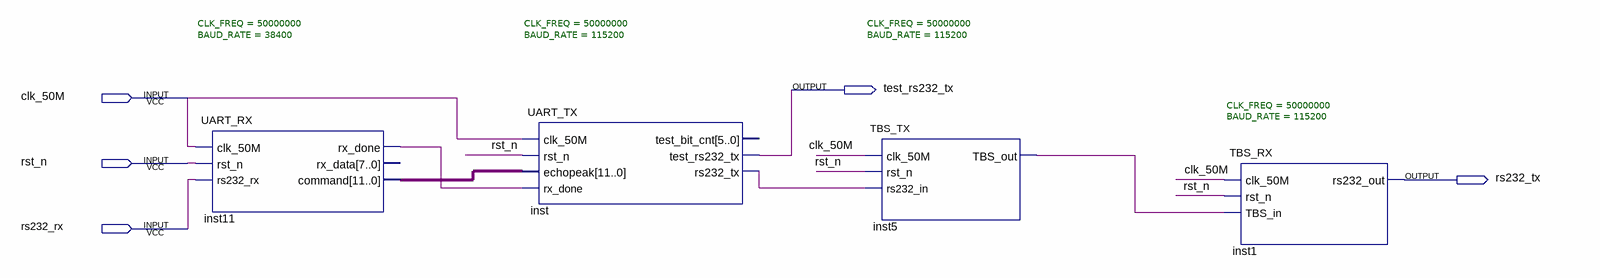
[diagram p0: schematic sheet]
// Quartus schematic TBS.bdf as structural Verilog: 4 symbols, 5 pins
module TBS (
  input  clk_50M,
  input  rst_n,
  input  rs232_rx,
  output test_rs232_tx,
  output rs232_tx
);

  wire inst5_tbs_out, inst11_rx_done, inst_rs232_tx;
  wire [11:0] inst11_command;

  UART_RX #(.CLK_FREQ(50000000), .BAUD_RATE(38400)) inst11 (
    .clk_50M(clk_50M), .rst_n(rst_n), .rs232_rx(rs232_rx), .rx_done(inst11_rx_done), .command(inst11_command));  // open: rx_data
  UART_TX #(.CLK_FREQ(50000000), .BAUD_RATE(115200)) inst (
    .clk_50M(clk_50M), .rst_n(rst_n), .echopeak(inst11_command), .rx_done(inst11_rx_done),
    .test_rs232_tx(test_rs232_tx), .rs232_tx(inst_rs232_tx));  // open: test_bit_cnt
  TBS_TX #(.CLK_FREQ(50000000), .BAUD_RATE(115200)) inst5 (
    .clk_50M(clk_50M), .rst_n(rst_n), .rs232_in(inst_rs232_tx), .TBS_out(inst5_tbs_out));
  TBS_RX #(.CLK_FREQ(50000000), .BAUD_RATE(115200)) inst1 (
    .clk_50M(clk_50M), .rst_n(rst_n), .TBS_in(inst5_tbs_out), .rs232_out(rs232_tx));
endmodule
